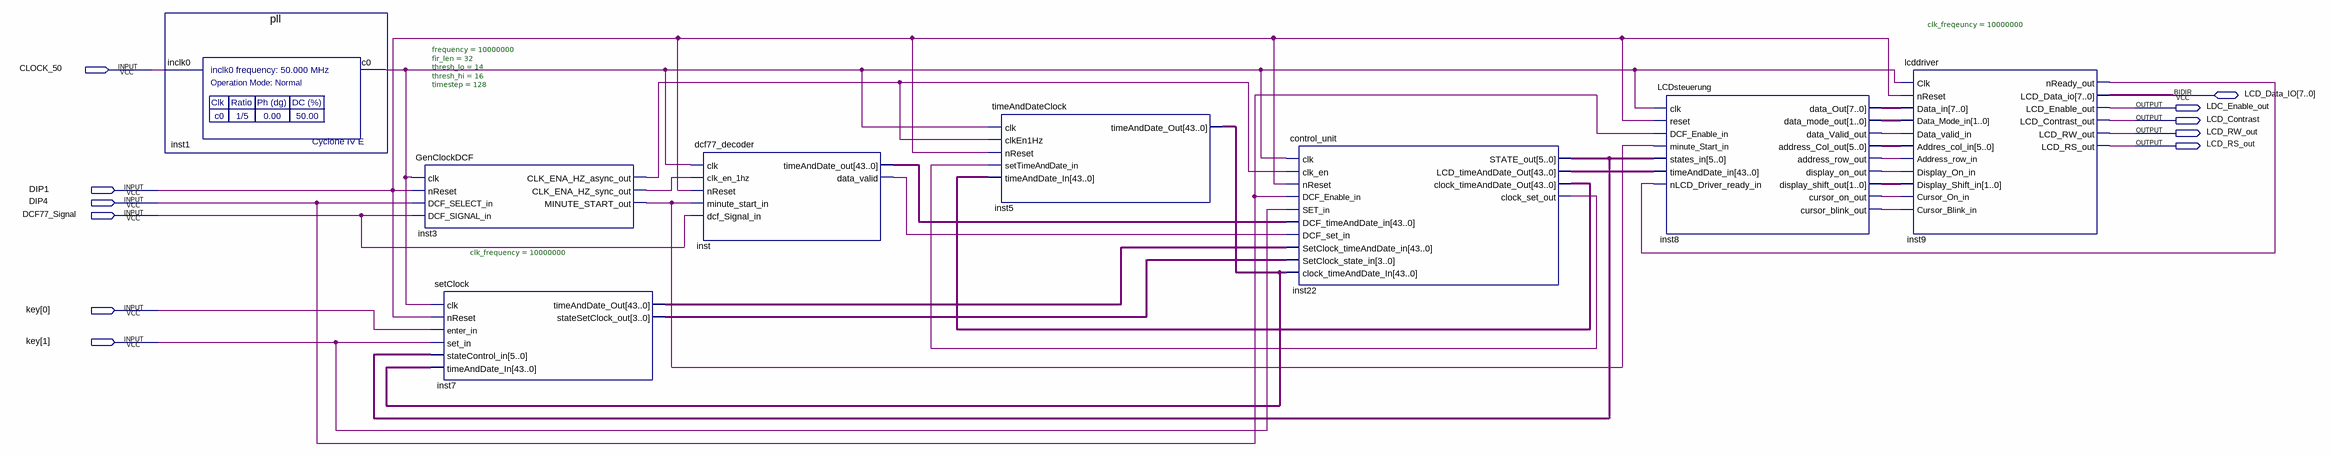
[diagram p0: schematic sheet]
// Quartus schematic my_first_fpga.bdf as structural Verilog: 8 symbols, 11 pins
module my_first_fpga (
  input  CLOCK_50,
  input  DIP1,
  input  DIP4,
  input  DCF77_Signal,
  input  [1:0] key,
  inout  [7:0] LCD_Data_IO,
  output LDC_Enable_out,
  output LCD_Contrast,
  output LCD_RW_out,
  output LCD_RS_out
);

  wire inst1_c0, inst3_clk_ena_hz_async_out, inst3_clk_ena_hz_sync_out, inst3_minute_start_out,
       inst8_address_row_out, inst8_cursor_blink_out, inst8_cursor_on_out, inst8_data_valid_out,
       inst8_display_on_out, inst9_nready_out, inst22_clock_set_out, inst_data_valid;
  wire [1:0] inst8_data_mode_out, inst8_display_shift_out;
  wire [3:0] inst7_statesetclock_out;
  wire [5:0] inst8_address_col_out, inst22_state_out;
  wire [7:0] inst8_data_out;
  wire [43:0] inst5_timeanddate_out, inst7_timeanddate_out, inst22_clock_timeanddate_out,
       inst22_lcd_timeanddate_out, inst_timeanddate_out;

  pll inst1 (.inclk0(CLOCK_50), .c0(inst1_c0));
  GenClockDCF #(.frequency(10000000), .fir_len(32), .thresh_lo(14), .thresh_hi(16), .timestep(128)) inst3 (
    .clk(inst1_c0), .nReset(DIP1), .DCF_SELECT_in(DIP4), .DCF_SIGNAL_in(DCF77_Signal),
    .CLK_ENA_HZ_async_out(inst3_clk_ena_hz_async_out), .CLK_ENA_HZ_sync_out(inst3_clk_ena_hz_sync_out),
    .MINUTE_START_out(inst3_minute_start_out));
  setClock #(.clk_frequency(10000000)) inst7 (
    .clk(inst1_c0), .nReset(DIP1), .enter_in(key[0]), .set_in(key[1]), .stateControl_in(inst22_state_out),
    .timeAndDate_In(inst5_timeanddate_out), .timeAndDate_Out(inst7_timeanddate_out),
    .stateSetClock_out(inst7_statesetclock_out));
  dcf77_decoder inst (
    .clk(inst1_c0), .clk_en_1hz(inst3_clk_ena_hz_sync_out), .nReset(DIP1),
    .minute_start_in(inst3_minute_start_out), .dcf_Signal_in(DCF77_Signal),
    .timeAndDate_out(inst_timeanddate_out), .data_valid(inst_data_valid));
  timeAndDateClock inst5 (
    .clk(inst1_c0), .clkEn1Hz(inst3_clk_ena_hz_async_out), .nReset(DIP1),
    .setTimeAndDate_in(inst22_clock_set_out), .timeAndDate_In(inst22_clock_timeanddate_out),
    .timeAndDate_Out(inst5_timeanddate_out));
  control_unit inst22 (
    .clk(inst1_c0), .clk_en(inst3_clk_ena_hz_async_out), .nReset(DIP1), .DCF_Enable_in(DIP4),
    .SET_in(key[1]), .DCF_timeAndDate_in(inst_timeanddate_out), .DCF_set_in(inst_data_valid),
    .SetClock_timeAndDate_in(inst7_timeanddate_out), .SetClock_state_in(inst7_statesetclock_out),
    .clock_timeAndDate_In(inst5_timeanddate_out), .STATE_out(inst22_state_out),
    .LCD_timeAndDate_Out(inst22_lcd_timeanddate_out), .clock_timeAndDate_Out(inst22_clock_timeanddate_out),
    .clock_set_out(inst22_clock_set_out));
  LCDsteuerung inst8 (
    .clk(inst1_c0), .reset(DIP1), .DCF_Enable_in(DIP4), .minute_Start_in(inst3_minute_start_out),
    .states_in(inst22_state_out), .timeAndDate_in(inst22_lcd_timeanddate_out),
    .nLCD_Driver_ready_in(inst9_nready_out), .data_Out(inst8_data_out), .data_mode_out(inst8_data_mode_out),
    .data_Valid_out(inst8_data_valid_out), .address_Col_out(inst8_address_col_out),
    .address_row_out(inst8_address_row_out), .display_on_out(inst8_display_on_out),
    .display_shift_out(inst8_display_shift_out), .cursor_on_out(inst8_cursor_on_out),
    .cursor_blink_out(inst8_cursor_blink_out));
  lcddriver #(.clk_freqeuncy(10000000)) inst9 (
    .Clk(inst1_c0), .nReset(DIP1), .Data_in(inst8_data_out), .Data_Mode_in(inst8_data_mode_out),
    .Data_valid_in(inst8_data_valid_out), .Addres_col_in(inst8_address_col_out),
    .Address_row_in(inst8_address_row_out), .Display_On_in(inst8_display_on_out),
    .Display_Shift_in(inst8_display_shift_out), .Cursor_On_in(inst8_cursor_on_out),
    .Cursor_Blink_in(inst8_cursor_blink_out), .nReady_out(inst9_nready_out), .LCD_Enable_out(LDC_Enable_out),
    .LCD_Contrast_out(LCD_Contrast), .LCD_RW_out(LCD_RW_out), .LCD_RS_out(LCD_RS_out),
    .LCD_Data_io(LCD_Data_IO));
endmodule
